# Altium project rear_controller.PrjPcb
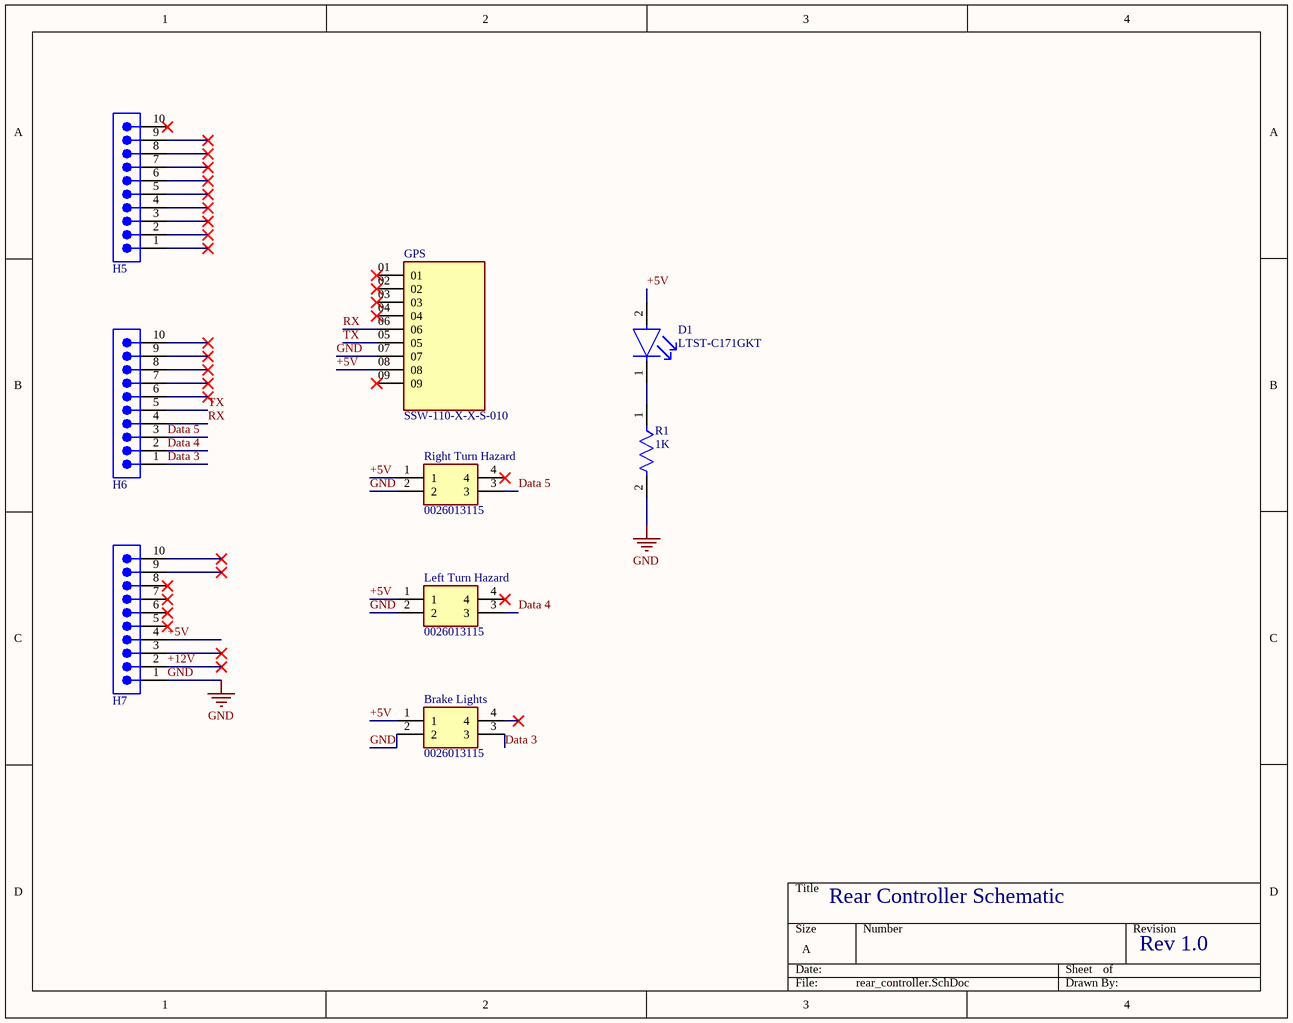
[diagram p0: rear_controller.SchDoc]
1 sheet, 9 parts. Net scope: global (net labels, ports and power ports of the same name join across sheets).
Board files: rear_controller.PcbDoc, rear_controller.PcbDoc

## Sheet rear_controller.SchDoc
size A; SheetNumber: 1; SheetTotal: 1

### Parts
Brake_Lights  0026013115  [MOLEX_0026013115]
D1  LTST-C171GKT  [FP-LTST-C171GKT-MFG]
GPS  SSW-110-X-X-S-010  [SAMTEC_SSW-110-X-X-S-010]
H5  61301011121  [61301011121]  (value not drawn)
H6  61301011121  [61301011121]  (value not drawn)
H7  61301011121  [61301011121]  (value not drawn)
Left_Turn_Hazard  0026013115  [MOLEX_0026013115]
R1  1K  [FP-AC0603-IPC_B]
Right_Turn_Hazard  0026013115  [MOLEX_0026013115]

### Nets
GND: Brake_Lights.2 GPS.07 H7.1 Left_Turn_Hazard.2 R1.2 Right_Turn_Hazard.2
+5V: Brake_Lights.1 D1.2(A) GPS.08 H7.4 Left_Turn_Hazard.1 Right_Turn_Hazard.1
+12V: H7.2
Data 3: Brake_Lights.3 H6.1
Data 4: H6.2 Left_Turn_Hazard.3
Data 5: H6.3 Right_Turn_Hazard.3
RX: GPS.06 H6.4
TX: GPS.05 H6.5
NetD1_1: D1.1(C) R1.1

Not connected (* = marked no-connect by the designer): Brake_Lights 4*; GPS 01* 02* 03* 04* 09*; H5 1* 2* 3* 4* 5* 6* 7* 8* 9* 10*; H6 6* 7* 8* 9* 10*; H7 3* 5* 6* 7* 8* 9* 10*; Left_Turn_Hazard 4*; Right_Turn_Hazard 4*

### Notes on the sheet
- Rear Controller Schematic
- Rev 1.0

### Library data of the parts
Brake_Lights Left_Turn_Hazard Right_Turn_Hazard = 0026013115: Connector Header Through Hole, Right Angle 4 position 0.165 (4.20mm); MF: Molex; Package: None; MP: 0026013115; DigiKey-Purchase-URL: https://snapeda.com/shop?store=DigiKey&id=2597941; Value: *; SnapEDA_Link: https://www.snapeda.com/parts/0026013115/Molex/view-part/2597941/?ref=snap; Price: None; Availability: Unavailable
D1 = CMP-22017-000007-1: LED GREEN CLEAR CHIP SMD; Luminous Intensity: 12mcd; Lens Color: Colorless; Dominant Wavelength: 569nm; Number of LEDs: 1; Power Dissipation: 100mW; Viewing Angle: 130°; Reverse Voltage: 5V; Test Current: 10mA; Forward Voltage: 2.1V; Wavelength: 585nm; Lens Style: Diffused; Forward Current: 30mA; Height: 0.8mm; Mount: Surface Mount; Package Quantity: 1; Length: 2mm; Case Code (Metric): 2012; Number of Pins: 2; Number of Elements: 1; Packaging: Tape and Reel; Color: Green; Min Operating Temperature: -55°C; Case/Package: 0805; Power Rating: 100mW; Max Operating Temperature: 85°C; Radiation Hardening: No; Depth: 1.25mm; Lens Transparency: Clear; Width: 1.25mm; Lead Free: Lead Free; Case Code (Imperial): 0805; Illumination Color: Green
GPS = SSW-110-X-X-S-010: 10 Position Receptacle Connector 0.100 (2.54mm) Through Hole Tin; MF: Samtec; MP: SSW-110-01-T-S-010; SnapEDA_Link: https://www.snapeda.com/parts/SSW-110-01-T-S-010/Samtec/view-part/?ref=snap; Package: None; Value: *; Check_prices: https://www.snapeda.com/parts/SSW-110-01-T-S-010/Samtec/view-part/?ref=eda
H5-H7 = 61301011121: WR-PHD Pin Header, THT, Vertical, pitch 2.54mm, 1 Row, 10P; Manufacturer: Wurth Elektronik; Contact Resistance: 20mOhm; Rated Current: 3A; Working Voltage: 250V; Withstanding Voltage: 500V; Manufacturer Part Number: 61301011121; Category: Board-to-Board Connectors; Match Code: WR-PHD; ComponentLink1Description: Website Link; ComponentLink1URL: https://www.we-online.com/redexpert/article/61301011121?ad; ComponentLink2Description: Datasheet Link; ComponentLink2URL: https://www.we-online.com/redexpert/spec/61301011121?ad; Mount: Through Hole; Operating Temperature Max: 105°C; Operating Temperature Min: -40°C; Packaging: Bag; Gender: Pin Header; Number of Pins: 10; Number of Rows: 1; Orientation: Vertical; Pitch: 2.54mm
R1 = CMP-2000-04828-3: RES 1kΩ 1.00% 0.1W 0603; Voltage Rating: 50V; Power Rating: 100mW; Tolerance: 1%; Temperature Coefficient: 100ppm/°C; Resistance: 1kR; Depth: 0.8mm; Case/Package: 0603; Size Code: 0603; Case Code (Metric): 1608; Height: 0.022inch; Series: AC; Width: 0.031inch; Construction: Rectangular; Length: 0.063inch; Case Code (Imperial): 0603; Package Quantity: 1; RoHS Compliant: Yes; Features: Moisture Resistant; Resistor Type: Thick Film; Max Power Dissipation: 100mW; Packaging: Tape and Reel; Termination: SMD/SMT; Ratings: AEC-Q200; Max Operating Temperature: 155°C; Min Operating Temperature: -55°C; Military Standard: Not; Lead Free: Lead Free; Number of Terminations: 2